# Altium schematic sheet mix_atten.SchDoc: mcHF Pro Transceiver Mixer board
size A3; Author: Krassi Atanassov; CompanyName: MØNKA; Engineer: For radio amateurs experimentation, non-commercial use only. Thank you!; Revision: 0.8.6; SheetTotal: 6
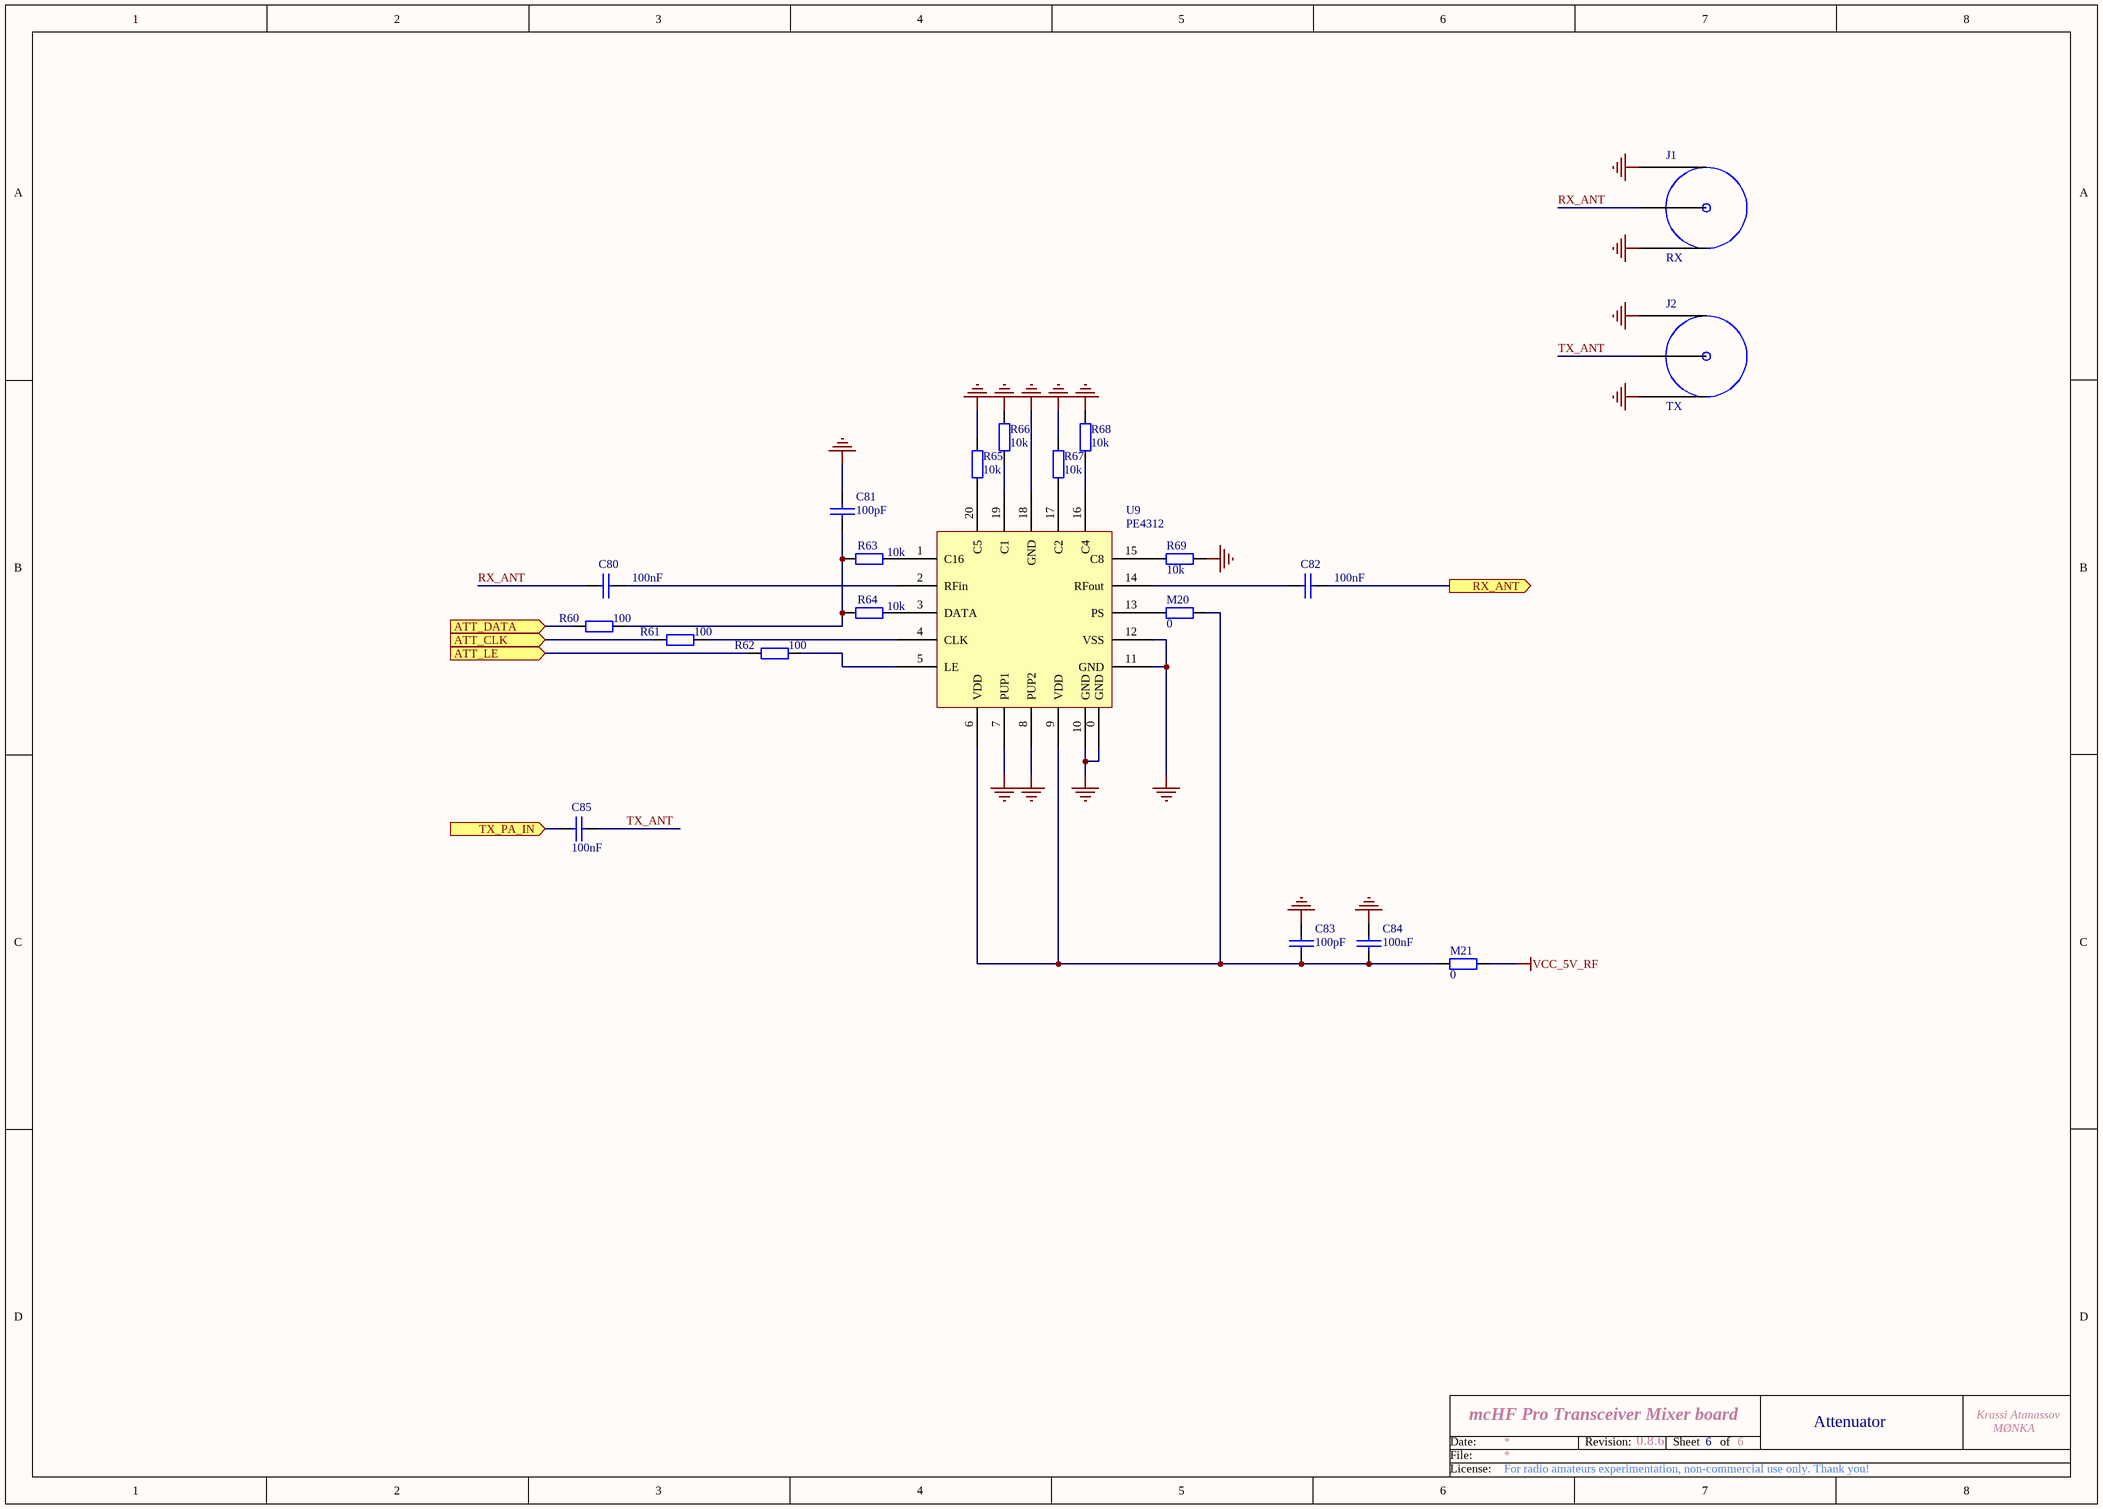
[diagram p0: mix_atten.SchDoc]

## Parts
C80  100nF  [0805]
C81  100pF  [0805]
C82  100nF  [0805]
C83  100pF  [0805]
C84  100nF  [0805]
C85  100nF  [0805]
J1  RX  [ufl]
J2  TX  [ufl]
M20  0  [0805]
M21  0  [0805]
R60  100  [0805]
R61  100  [0805]
R62  100  [0805]
R63  10k  [0805]
R64  10k  [0805]
R65  10k  [0805]
R66  10k  [0805]
R67  10k  [0805]
R68  10k  [0805]
R69  10k  [0805]
U9  PE4312  [QFN20_4X4]

## Ports
ATT_CLK (in), ATT_DATA (in), ATT_LE (in), RX_ANT (out), TX_PA_IN (in)

## Nets
GND: C81.2 C83.2 C84.2 J1.1 J1.3 J2.1 J2.3 R65.2 R66.2 R67.2 R68.2 R69.1 U9.0(GND) U9.7(PUP1) U9.8(PUP2) U9.10(GND) U9.11(GND) U9.12(VSS) U9.18(GND)
VCC_5V_RF: M21.2
ATT_CLK: R61.2 ; port ATT_CLK
ATT_DATA: R60.2 ; port ATT_DATA
ATT_LE: R62.2 ; port ATT_LE
RX_ANT: C80.2 J1.2
RX_ANT: C82.1 ; port RX_ANT  [a separate net that carries the same name]
TX_ANT: C85.1 J2.2
TX_PA_IN: C85.2 ; port TX_PA_IN
NetC80_1: C80.1 U9.2(RFin)
NetC81_1: C81.1 R60.1 R63.1 R64.1
NetC82_2: C82.2 U9.14(RFout)
NetC83_1: C83.1 C84.1 M20.2 M21.1 U9.6(VDD) U9.9(VDD)
NetM20_1: M20.1 U9.13(PS)
NetR61_1: R61.1 U9.4(CLK)
NetR62_1: R62.1 U9.5(LE)
NetR63_2: R63.2 U9.1(C16)
NetR64_2: R64.2 U9.3(DATA)
NetR65_1: R65.1 U9.20(C5)
NetR66_1: R66.1 U9.19(C1)
NetR67_1: R67.1 U9.17(C2)
NetR68_1: R68.1 U9.16(C4)
NetR69_2: R69.2 U9.15(C8)

## Notes on the sheet
- 6
- Attenuator
- Date:
- File:
- Revision:
- Sheet
- of
- License:

## Library data of the parts
C80-C85 = CAP: Capacitor; Order: FN 252-2090; QT Order: QCC-00154; Price: 0.068
J1 J2 = UFL
M20 M21 = RES: Resistor; Order: FN 933-3681; QT Order: QCR-00268; Price: 0.009
R60-R69 = RES: Resistor; Order: FN 933-2375; QT Order: QCR-00301; Price: 0.027
U9 = PE4312: 4Ghz Attenuator